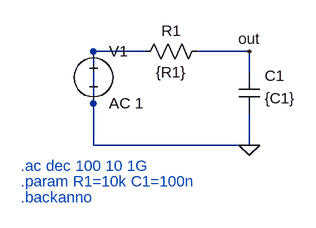
[diagram p0: schematic example_rc_filter.asc]
example_rc_filter.asc, the LTspice schematic file:
Version 4
SHEET 1 880 680
WIRE 160 160 80 160
WIRE 320 160 240 160
WIRE 320 192 320 160
WIRE 320 304 320 256
WIRE 80 304 80 160
WIRE 80 304 320 304
SYMBOL voltage 80 144 R0
WINDOW 123 0 0 Left 0
WINDOW 39 0 0 Left 0
SYMATTR InstName V1
SYMATTR Value AC 1
SYMBOL res 256 144 R90
WINDOW 0 0 56 VBottom 2
WINDOW 3 32 56 VTop 2
SYMATTR InstName R1
SYMATTR Value {R1}
SYMBOL cap 304 192 R0
WINDOW 0 40 5 Left 2
WINDOW 3 40 40 Left 2
SYMATTR InstName C1
SYMATTR Value {C1}
FLAG 320 304 0
FLAG 320 160 out
TEXT -32 336 Left 2 .ac dec 100 10 1G
TEXT -32 360 Left 2 .param R1=10k C1=100n
TEXT -32 384 Left 2 .backanno

The netlist it stands for:
* example_rc_filter.asc
V1 0 0 AC 1
R1 out 0 {R1}
C1 out 0 {C1}
* .ac dec 100 10 1G
* .param R1=10k C1=100n
* .backanno
.backanno
.end